# EAGLE design chargerboardrev1 (EAGLE 9.1.3)
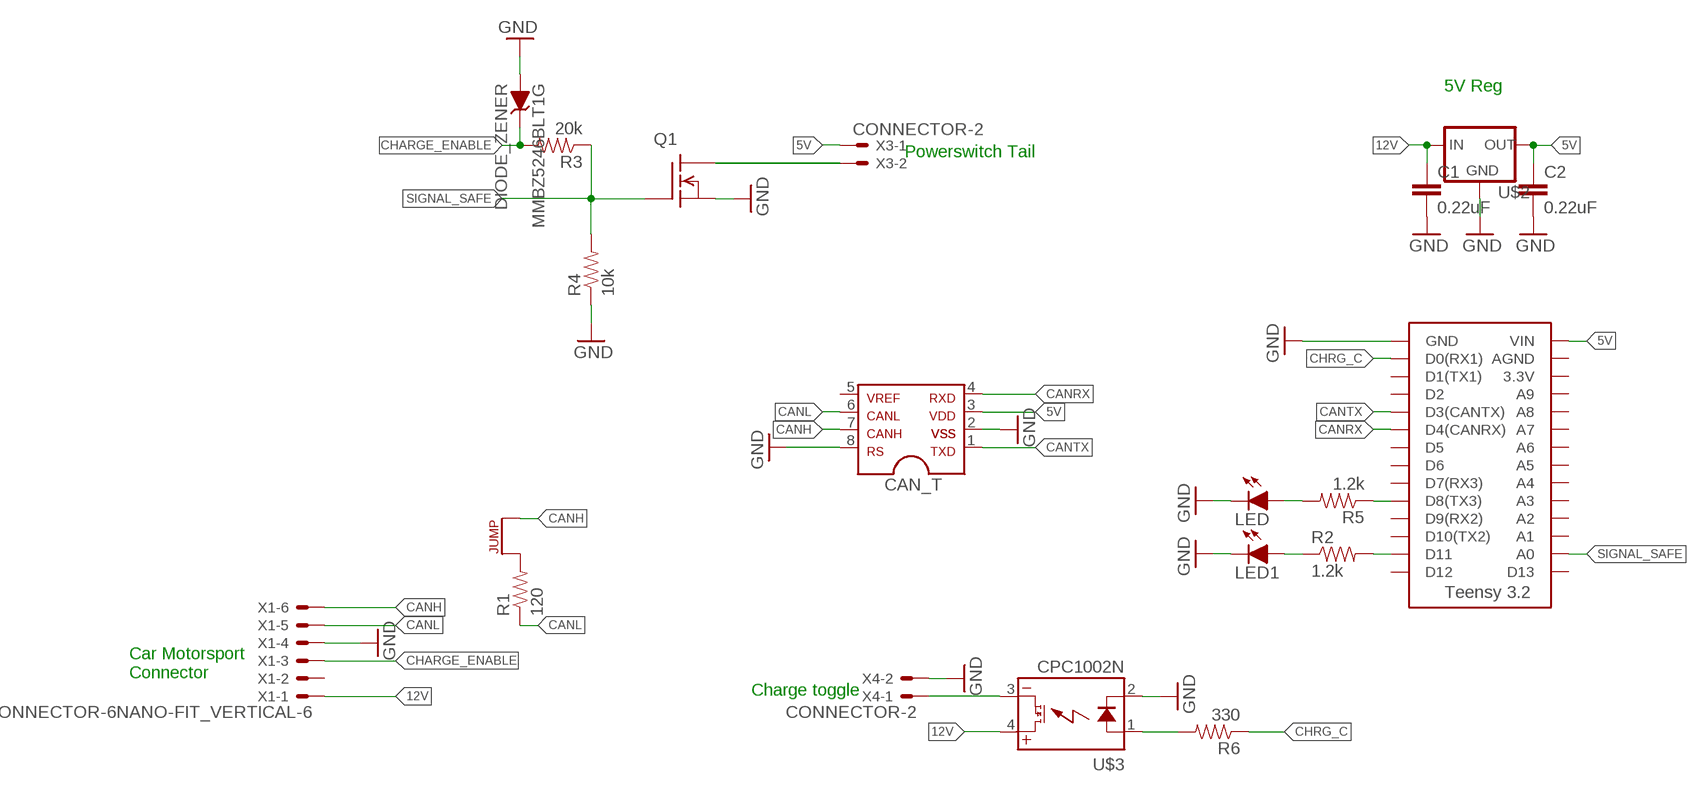
[diagram p0: schematic, sheet 1]

## Parts
C1  0.22uF  CAP0805  [0805]
C2  0.22uF  CAP0805  [0805]
CAN_T  MCP2551  [SOIC-08]
J1  JUMPER.1  [1X02]
LED  LED-0805  [LED-805]
LED1  LED-0805  [LED-805]
MMBZ5246BLT1G  DIODE_ZENER  [SOT23]
Q1  DMG3406LSOT  [SOT23]
R1  120  RESISTOR0805-RES  [0805]
R2  1.2k  RESISTOR0805-RES  [0805]
R3  20k  RESISTOR0805-RES  [0805]
R4  10k  RESISTOR0805-RES  [0805]
R5  1.2k  RESISTOR0805-RES  [0805]
R6  330  RESISTOR0805-RES  [0805]
U$1  TEENSY_3.2_SIMPLE  [TEENSY_3.2_SIMPLE]
U$2  5VREG_LM340-NLM340MPX-5.0/NOPB  [SOT223]
U$3  CPC1002N  [SOP04]
X1  CONNECTOR-6NANO-FIT_VERTICAL-6  [NANO-FIT_VERTICAL-6]
X3  CONNECTOR-2  [MINIFIT_5566-2]
X4  CONNECTOR-2  [MINIFIT_5566-2]

## Nets
5V: C2.1 CAN_T.3 U$1.VIN U$2.3(OUT) X3.1
12V: C1.1 U$2.1(IN) U$3.4(DC+) X1.P$1
CANH: CAN_T.7 J1.2 X1.P$6
CANL: CAN_T.6 R1.1 X1.P$5
CANRX: CAN_T.4 U$1.D4(CANRX)
CANTX: CAN_T.1 U$1.D3(CANTX)
CHARGE_ENABLE: MMBZ5246BLT1G.3(C) R3.2 X1.P$3
CHRG_C: R6.1 U$1.D0(RX1)
GND: C1.2 C2.2 CAN_T.2 CAN_T.8 LED1.C LED.C MMBZ5246BLT1G.1(A) Q1.2(S) R4.1 U$1.GND U$2.2(GND) U$2.4(GND) U$3.2(CONTROL-) X1.P$4 X4.2
N$1: Q1.3(D) X3.2
N$2: R2.2 U$1.D11
N$3: R5.1 U$1.D8(TX3)
N$4: LED1.A R2.1
N$5: J1.1 R1.2
N$6: LED.A R5.2
N$7: U$3.3(DC-) X4.1
N$10: R6.2 U$3.1(CONTROL+)
SIGNAL_SAFE: Q1.1(G) R3.1 R4.2 U$1.A0
Unconnected: CAN_T.5 U$1.3.3V U$1.A1 U$1.A2 U$1.A3 U$1.A4 U$1.A5 U$1.A6 U$1.A7 U$1.A8 U$1.A9 U$1.AGND U$1.D1(TX1) U$1.D2 U$1.D5 U$1.D6 U$1.D7(RX3) U$1.D9(RX2) U$1.D10(TX2) U$1.D12 U$1.D13 X1.P$2

## Notes on the sheet
- 5V Reg
- Powerswitch Tail
- Car Motorsport
  Connector
- Charge toggle

## Library data of the parts
C1 C2 = HyTechDevices:CAP: Capacitor Standard 0603 ceramic capacitor, and 0.1" leaded capacitor.
CAN_T = HyTechDevices:MCP2551: MCP2551 High-Speed CAN Transceiver Product Webpage <https://www.microchip.com/wwwproducts/en/MCP2551> Datasheet <http://ww1.microchip.com/downloads/en/DeviceDoc/21667f.pdf> This device is outdated It is replaced by MCP2561. Comparison Page <https://www.microchip.com/wwwproducts/ProductCompare/MCP2551/MCP2561> Product Webpage <https://www.microchip.com/wwwproducts/en/MCP2561> Datasheet <http://ww1.microchip.com/downloads/en/DeviceDoc/20005167C.pdf>
J1 = HyTechDevices:JUMPER: Jumper for changing operation of a device
LED LED1 = HyTechDevices:LED: Light Emitting Diode (LED) Source: Dangerous Prototypes Eagle Library <https://github.com/DangerousPrototypes/Eagle_Part_Library>
MMBZ5246BLT1G = HyTechDevices:DIODE_ZENER: ZENER DIODE
Q1 = HyTechDevices:DMG3406L: Generic NPN MOSFET DMG3406L (SOT-23, 2.8 A 30V)
R1-R6 = HyTechDevices:RESISTOR: Resistor Basic schematic elements and footprints for 0603, 1206, and PTH resistors.
U$1 = HyTechDevices:TEENSY_3.2_SIMPLE: Simple version of the Teensy 3.2 board that only uses the 2 main rows of pins, not the inner pins or the pins opposite the usb port.
U$2 = HyTechDevices:5VREG_LM340-N: Voltage Regulator 5v linear voltage regulator Datasheet <http://www.mouser.com/ProductDetail/Texas-Instruments/LM340MPX-50-NOPB/?qs=X1J7HmVL2ZGZwtTFRQ9ItA%3D%3D> MAX current out: 1.5A MAX voltage in: 35V
U$3 = HyTechDevices:CPC1002N: IXYS Solid State Relay .7A
X1 = HyTechDevices:CONNECTOR-6: Mini-Fit Junior connector 6 pole Source: http://www.molex.com
X3 X4 = HyTechDevices:CONNECTOR-2: Mini-Fit Junior connector 2 pole Source: http://www.molex.com; OC_FARNELL: 1822072; OC_NEWARK: unknown

## Board
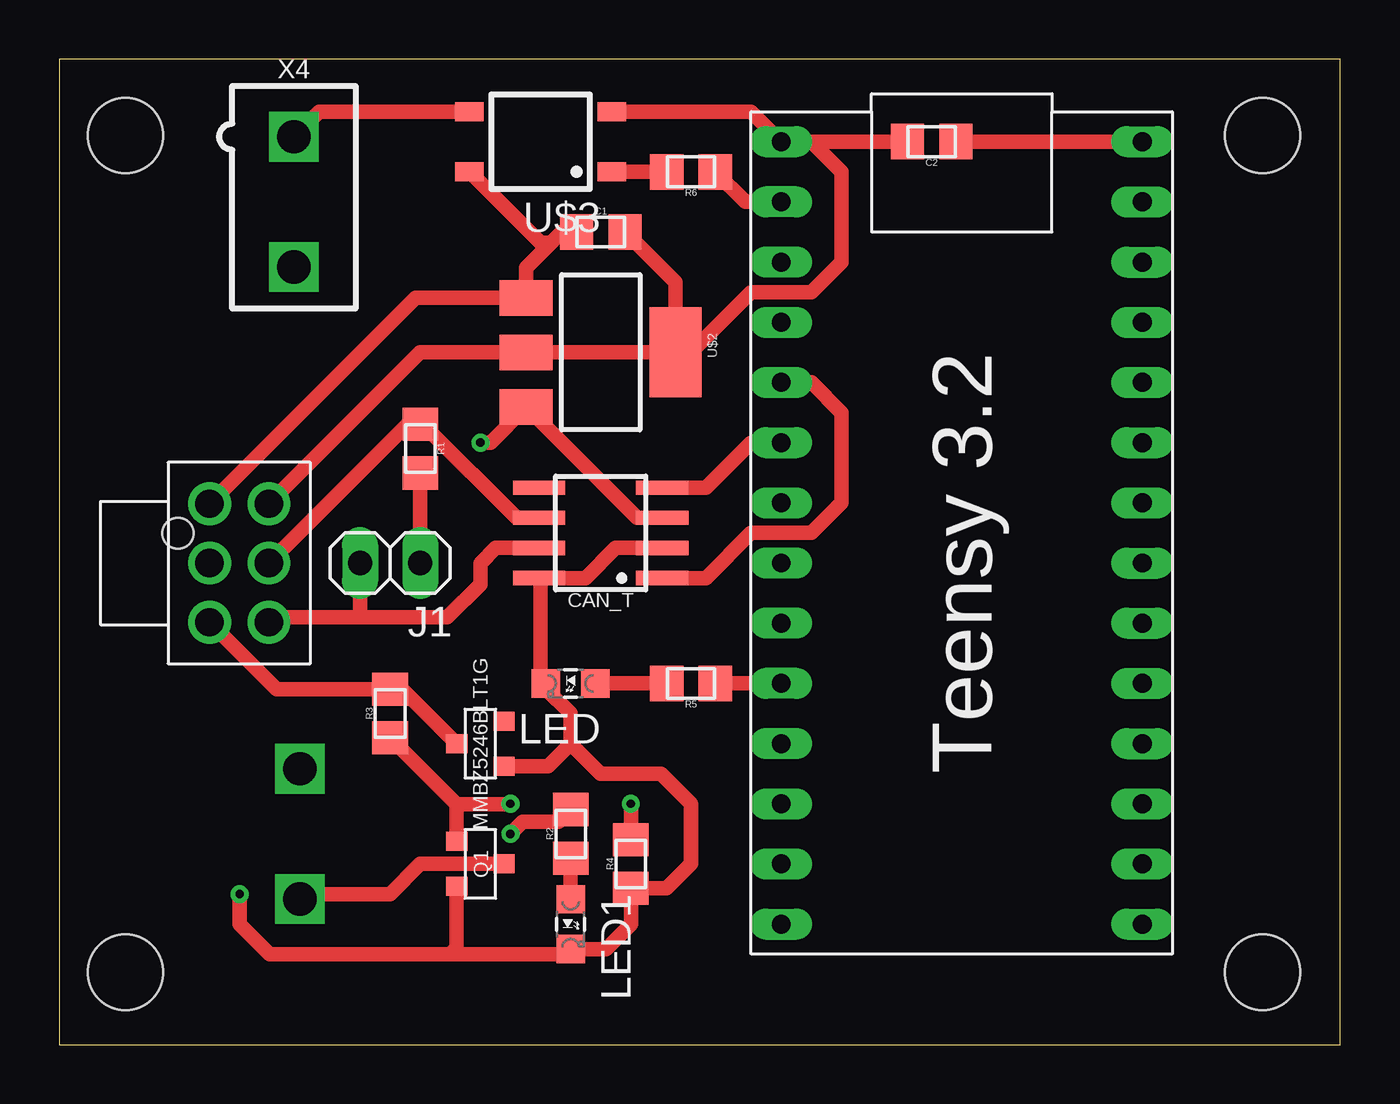
[diagram p1: board, top side]
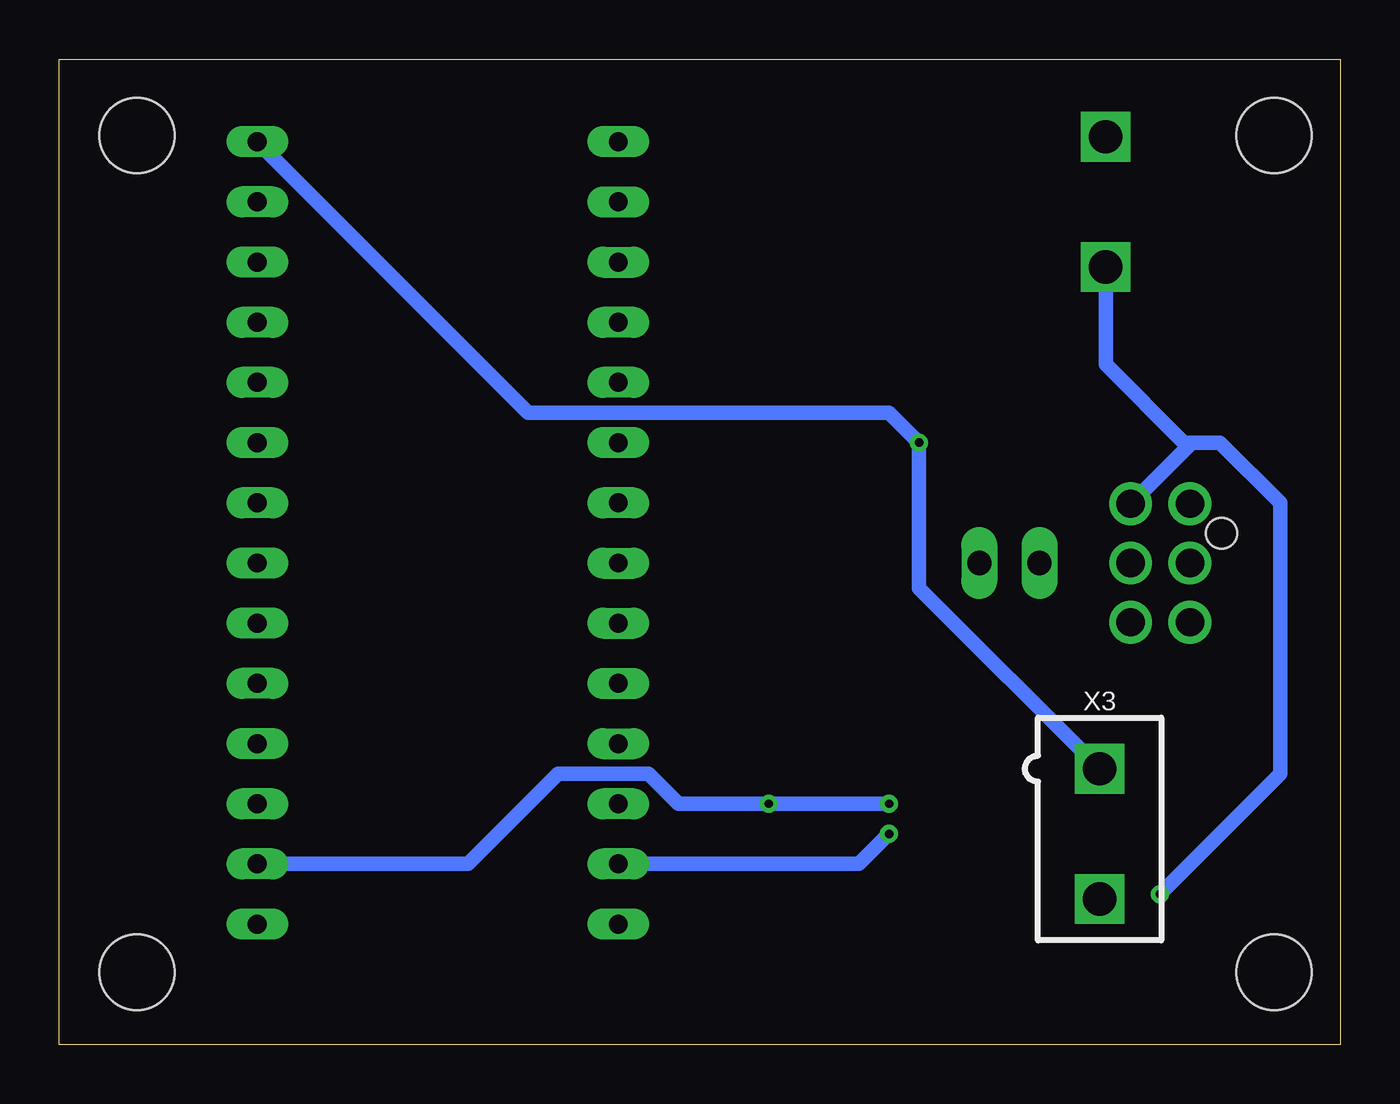
[diagram p2: board, bottom side, seen from below]

Size 54.08 x 41.58 mm. Coordinates in mm from the lower left corner, seen from the top.
Outline: 0,0 54.08,0 54.08,41.58 0,41.58 0,0
Copper layers (1*16): Top 0.035mm / dielectric 1.5mm / Bottom 0.035mm
Design rules "DRC Advanced Circuits": minimum track width 6mil, minimum drill 10mil, track to track 6mil, track to pad 6mil, pad to pad 6mil, via to via 6mil, smd to smd 6mil, copper to edge 40mil, drill to drill 6mil, minimum pad ring 10mil, minimum via ring 8mil, stop-mask expansion 4mil, vias tented up to drill 0mil, thermal gap 10mil
Holes 3.17 mm at 2.79,38.35 2.79,3.05 50.8,3.05 50.8,38.35

### Footprints (pad centres in the part's own frame; a part is rotated, then mirrored left to right if it is on the bottom)
0805 = smd 1.4 x 1.5: 1 -1.025,0; 2 1.025,0
SOIC-08 = smd 0.6 x 2.2: 1 -1.905,-2.6; 2 -0.635,-2.6; 3 0.635,-2.6; 4 1.905,-2.6; 5 1.905,2.6; 6 0.635,2.6; 7 -0.635,2.6; 8 -1.905,2.6
1X02 = drill 1.016 long: 1 -1.27,0; 2 1.27,0
LED-805 = smd 1.2 x 1.2: A 0,-1.05; C 0,1.05
SOT23 = smd 0.8 x 0.9: 1 -0.95,-1; 2 0.95,-1; 3 0,1
TEENSY_3.2_SIMPLE = drill 0.8 long: 3.3V 16.51,29.21; A0 16.51,3.81; A1 16.51,6.35; A2 16.51,8.89; A3 16.51,11.43; A4 16.51,13.97; A5 16.51,16.51; A6 16.51,19.05; A7 16.51,21.59; A8 16.51,24.13; A9 16.51,26.67; AGND 16.51,31.75; D0(RX1) 1.27,31.75; D1(TX1) 1.27,29.21; D2 1.27,26.67; D3(CANTX) 1.27,24.13; D4(CANRX) 1.27,21.59; D5 1.27,19.05; D6 1.27,16.51; D7(RX3) 1.27,13.97; D8(TX3) 1.27,11.43; D9(RX2) 1.27,8.89; D10(TX2) 1.27,6.35; D11 1.27,3.81; D12 1.27,1.27; D13 16.51,1.27; GND 1.27,34.29; VIN 16.51,34.29
SOT223 = smd 1.5 x 2.235: 1 -2.3,-3.15; 2 0,-3.15; 3 2.3,-3.15 | smd 3.8 x 2.2: 4 0,3.15
SOP04 = smd 0.8 x 1.2: 1 -1.27,-3; 2 1.27,-3; 3 1.27,3; 4 -1.27,3
NANO-FIT_VERTICAL-6 = drill 1.2: P$1 -2.5,0; P$2 0,0; P$3 2.5,0; P$4 -2.5,2.5; P$5 0,2.5; P$6 2.5,2.5 | hole 1.3: -1.25,-1.34
MINIFIT_5566-2 = drill 1.4 square: 1 0,-2.75; 2 0,2.75

### Placement (x,y rotation side)
C1  22.86,34.29 0 top
C2  36.83,38.1 180 top
CAN_T  22.86,21.59 90 top
J1  13.97,20.32 180 top
LED  21.59,15.24 90 top
LED1  21.59,5.08 180 top
MMBZ5246BLT1G  17.78,12.7 90 top
Q1  17.78,7.62 270 top
R1  15.24,25.15 270 top
R2  21.59,8.89 90 top
R3  13.97,13.97 90 top
R4  24.13,7.62 90 top
R5  26.67,15.24 180 top
R6  26.67,36.83 180 top
U$1  29.21,3.81 0 top
U$2  22.86,29.21 270 top
U$3  20.32,38.1 90 top
X1  6.35,20.32 270 top
X3  10.16,8.89 180 bottom
X4  9.91,35.56 180 top

### Tracks (layer width: path | path; a pad name or v marks a point on that pad's centre or on a via)
5V  (via drill 0.35)
  Top 0.61: CAN_T.3 24.4,22.22 U$2.3 18.2,25.4 v17.78,25.4 | C2.1 U$1.VIN
  Bottom 0.61: X3.1 17.78,19.26 v17.78,25.4 19.05,26.67 34.29,26.67 U$1.VIN
12V
  Top 0.61: X1.P$1 15.04,31.51 U$2.1 19.71,32.78 20.77,33.84 | 20.77,33.84 21.22,34.29 C1.1 | U$3.4 20.31,33.84 20.77,33.84
CANH
  Top 0.61: CAN_T.7 18.42,20.95 17.78,20.32 17.78,19.43 16.38,18.03 16.38,18.02 12.7,18.02 | X1.P$6 9.06,18.02 11.39,18.02 12.7,18.02 | J1.2 12.7,18.02
CANL
  Top 0.61: CAN_T.6 19.3,22.22 15.49,26.04 15.38,26.04 R1.1 14.7,26.17 X1.P$5
CANRX
  Top 0.61: CAN_T.4 27.31,23.5 29.21,25.4 U$1.D4(CANRX)
CANTX
  Top 0.61: CAN_T.1 27.31,19.68 29.21,21.59 31.75,21.59 33.02,22.86 | 33.02,22.86 33.02,26.67 31.75,27.94 U$1.D3(CANTX) | 33.02,22.86
CHARGE_ENABLE
  Top 0.61: X1.P$3 9.17,14.99 R3.2 14.48,14.99 MMBZ5246BLT1G.3
CHRG_C
  Top 0.61: U$1.D0(RX1) 29.21,35.56 28.97,35.56 R6.1
GND  (via drill 0.35)
  Top 0.61: U$3.2 29.21,39.37 U$1.GND 31.75,38.1 | X1.P$4 15.24,29.21 U$2.2 U$2.4 | CAN_T.2 23.5,20.95 22.22,19.68 CAN_T.8 20.32,19.62 20.32,15.46 LED.C 20.54,15.02 21.59,13.97 21.59,12.7 | 31.75,38.1 33.02,36.83 33.02,33.02 31.75,31.75 29.21,31.75 26.67,29.21 U$2.4 | 16.51,3.81 8.89,3.81 7.62,5.08 v7.62,6.35 | 16.51,3.81 21.37,3.81 LED1.C 23.08,4.03 24.13,5.08 R4.1 25.65,6.6 26.67,7.62 26.67,10.16 25.4,11.43 22.86,11.43 21.59,12.7 | 21.59,12.7 20.64,11.75 MMBZ5246BLT1G.1 | Q1.2 16.78,4.08 16.51,3.81 | C1.2 26.01,32.16 U$2.4 | 31.75,38.1 C2.2
  Bottom 0.61: v7.62,6.35 2.54,11.43 2.54,22.86 5.08,25.4 6.1,25.4 | 6.1,25.4 6.6,25.4 9.91,28.7 X4.2 | X1.P$4 6.27,25.4 6.1,25.4
N$1
  Top 0.61: X3.2 10.37,6.35 13.97,6.35 15.24,7.62 Q1.3
N$2  (via drill 0.35)
  Top 0.61: R2.2 21.07,9.4 19.56,9.4 v19.05,8.89
  Bottom 0.61: U$1.D11 20.32,7.62 v19.05,8.89
N$3
  Top 0.61: U$1.D8(TX3) R5.1
N$4
  Top 0.61: R2.1 LED1.A
N$5
  Top 0.61: R1.2 J1.1
N$6
  Top 0.61: R5.2 LED.A
N$7
  Top 0.61: U$3.3 10.97,39.37 X4.1
N$10
  Top 0.61: U$3.1 R6.2
SIGNAL_SAFE  (via drill 0.35)
  Top 0.61: 16.78,10.13 Q1.1 | R3.1 16.78,10.13 | v24.13,10.16 R4.2 | 16.78,10.13 19.03,10.13 v19.05,10.16
  Bottom 0.61: v19.05,10.16 v24.13,10.16 27.94,10.16 29.21,11.43 33.02,11.43 36.83,7.62 U$1.A0

### Text on the board
tDocu: Designed by: / Dean Plaskon | HyTech Racing 2019 Charger Board Rev1